# EAGLE schematic AVRI2CIO_V0_2_LEVEL1 (EAGLE 6.5.0)
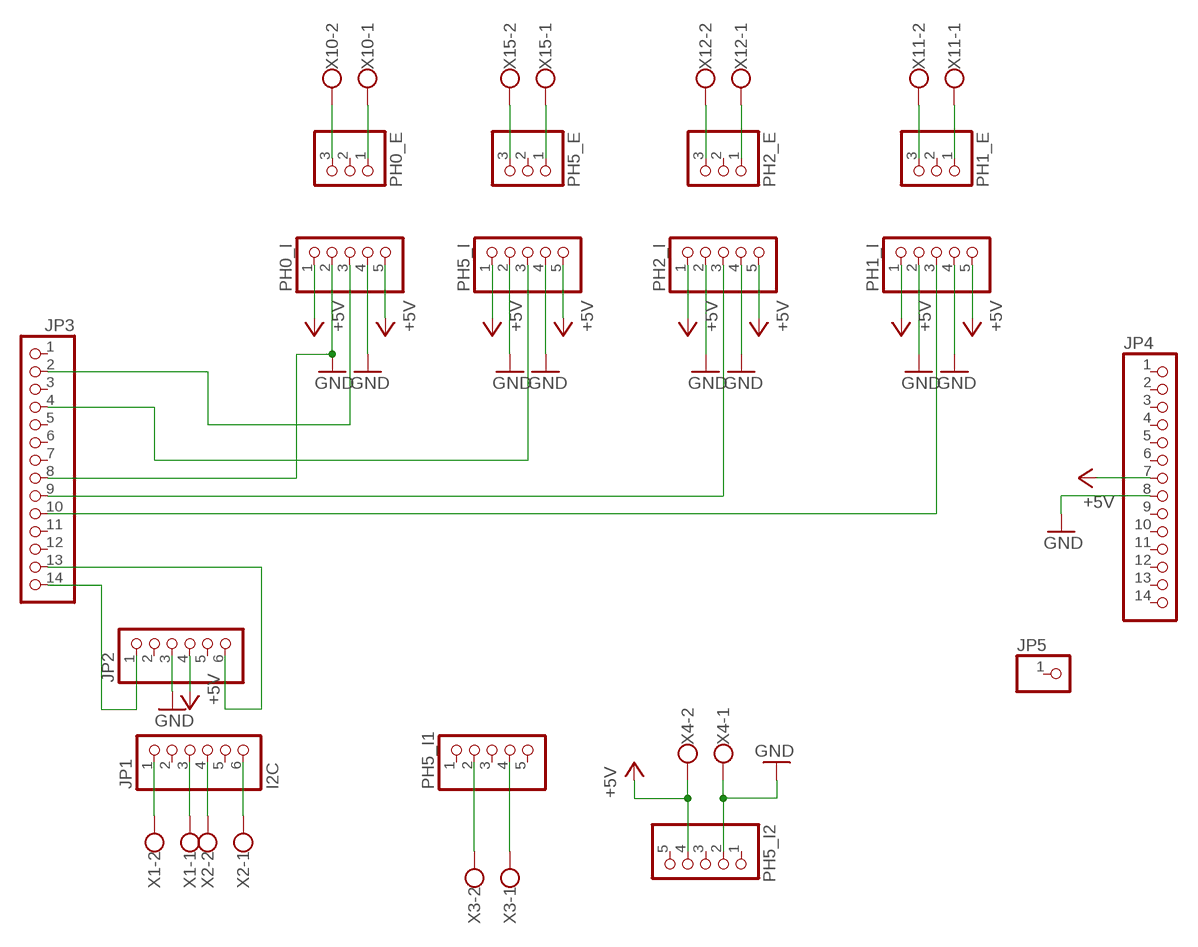
[diagram p0: schematic, sheet 1]

## Parts
JP1  I2C  PINHD-1X6  [1X06]
JP2  PINHD-1X6  [1X06]
JP3  PINHD-1X14  [1X14]
JP4  PINHD-1X14  [1X14]
JP5  PINHD-1X1  [1X01]
PH0_E  PINHD-1X3  [1X03]
PH0_I  PINHD-1X5  [1X05]
PH1_E  PINHD-1X3  [1X03]
PH1_I  PINHD-1X5  [1X05]
PH2_E  PINHD-1X3  [1X03]
PH2_I  PINHD-1X5  [1X05]
PH5_E  PINHD-1X3  [1X03]
PH5_I  PINHD-1X5  [1X05]
PH5_I1  PINHD-1X5  [1X05]
PH5_I2  PINHD-1X5  [1X05]
X1  W237-102  [W237-102]
X2  W237-102  [W237-102]
X3  W237-102  [W237-102]
X4  W237-102  [W237-102]
X10  W237-102  [W237-102]
X11  W237-102  [W237-102]
X12  W237-102  [W237-102]
X15  W237-102  [W237-102]

## Nets
+5V: JP2.4 JP4.7 PH0_I.1 PH0_I.5 PH1_I.1 PH1_I.5 PH2_I.1 PH2_I.5 PH5_I2.4 PH5_I.1 PH5_I.5 X4.2
GND: JP2.3 JP3.8 JP4.8 PH0_I.2 PH0_I.4 PH1_I.2 PH1_I.4 PH2_I.2 PH2_I.4 PH5_I2.2 PH5_I.2 PH5_I.4 X4.1
N$1: PH0_E.3 X10.2
N$2: PH0_E.1 X10.1
N$5: JP3.10 PH1_I.3
N$6: JP3.9 PH2_I.3
N$7: JP1.1 X1.2
N$8: JP1.3 X1.1
N$9: JP1.4 X2.2
N$10: JP1.6 X2.1
N$11: JP2.1 JP3.14
N$12: JP2.6 JP3.13
N$14: PH5_I1.2 X3.2
N$16: PH5_I1.4 X3.1
N$18: JP3.2 PH0_I.3
N$19: PH1_E.1 X11.1
N$20: PH1_E.3 X11.2
N$22: JP3.4 PH5_I.3
N$23: PH2_E.1 X12.1
N$24: PH2_E.3 X12.2
N$29: PH5_E.1 X15.1
N$30: PH5_E.3 X15.2
Unconnected: JP1.2 JP1.5 JP2.2 JP2.5 JP3.1 JP3.3 JP3.5 JP3.6 JP3.7 JP3.11 JP3.12 JP4.1 JP4.2 JP4.3 JP4.4 JP4.5 JP4.6 JP4.9 JP4.10 JP4.11 JP4.12 JP4.13 JP4.14 JP5.1 PH0_E.2 PH1_E.2 PH2_E.2 PH5_E.2 PH5_I1.1 PH5_I1.3 PH5_I1.5 PH5_I2.1 PH5_I2.3 PH5_I2.5

## Library data of the parts
JP1 JP2 = pinhead:PINHD-1X6: PIN HEADER
JP3 JP4 = pinhead:PINHD-1X14: PIN HEADER
JP5 = pinhead:PINHD-1X1: PIN HEADER
PH0_E PH1_E PH2_E PH5_E = pinhead:PINHD-1X3: PIN HEADER
PH0_I PH1_I PH2_I PH5_I PH5_I1 PH5_I2 = pinhead:PINHD-1X5: PIN HEADER
X1-X4 X10-X12 X15 = con-wago-500:W237-102: WAGO SCREW CLAMP; MPN: 237-102; OC_FARNELL: unknown; OC_NEWARK: 70K9898